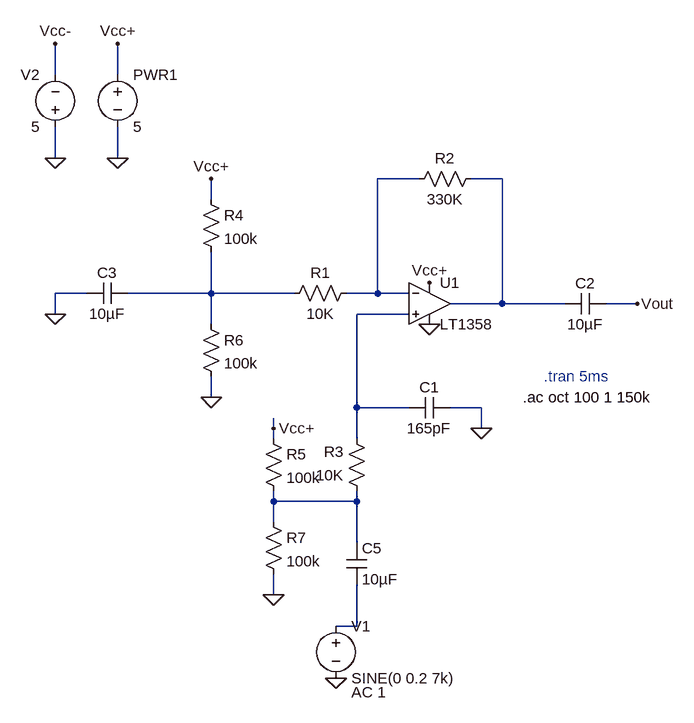
[diagram p0: schematic karens_new_amplifer_corrent_filtering.asc]
karens_new_amplifer_corrent_filtering.asc, the LTspice schematic file:
Version 4
SHEET 1 996 852
WIRE 32 -112 32 -160
WIRE 128 -112 128 -160
WIRE 32 16 32 -32
WIRE 128 16 128 -32
WIRE 592 48 528 48
WIRE 720 48 672 48
WIRE 272 80 272 48
WIRE 80 224 32 224
WIRE 272 224 272 160
WIRE 272 224 144 224
WIRE 400 224 272 224
WIRE 528 224 528 48
WIRE 528 224 480 224
WIRE 576 224 528 224
WIRE 720 240 720 48
WIRE 720 240 640 240
WIRE 816 240 720 240
WIRE 928 240 880 240
WIRE 32 256 32 224
WIRE 576 256 496 256
WIRE 272 272 272 224
WIRE 272 384 272 352
WIRE 496 400 496 256
WIRE 576 400 496 400
WIRE 688 400 640 400
WIRE 368 432 368 416
WIRE 688 432 688 400
WIRE 368 448 368 432
WIRE 496 448 496 400
WIRE 368 544 368 528
WIRE 496 544 496 528
WIRE 496 544 368 544
WIRE 368 576 368 544
WIRE 496 608 496 544
WIRE 368 688 368 656
WIRE 496 736 496 672
WIRE 496 736 464 736
FLAG 608 208 Vcc+
FLAG 608 272 0
FLAG 928 240 Vout
FLAG 272 48 Vcc+
FLAG 272 384 0
FLAG 32 256 0
FLAG 368 688 0
FLAG 368 432 Vcc+
FLAG 688 432 0
FLAG 464 816 0
FLAG 128 -160 Vcc+
FLAG 128 16 0
FLAG 32 16 0
FLAG 32 -160 Vcc-
SYMBOL Res 496 208 R90
WINDOW 0 0 56 VBottom 2
WINDOW 3 32 56 VTop 2
SYMATTR InstName R1
SYMATTR Value 10K
SYMBOL OpAmps/LT1358 608 176 R0
SYMATTR InstName U1
SYMBOL Res 688 32 R90
WINDOW 0 0 56 VBottom 2
WINDOW 3 32 56 VTop 2
SYMATTR InstName R2
SYMATTR Value 330K
SYMBOL Res 256 64 R0
SYMATTR InstName R4
SYMATTR Value 100k
SYMBOL Res 256 256 R0
SYMATTR InstName R6
SYMATTR Value 100k
SYMBOL Cap 144 208 R90
WINDOW 0 0 32 VBottom 2
WINDOW 3 32 32 VTop 2
SYMATTR InstName C3
SYMATTR Value 10µF
SYMBOL voltage 464 720 R0
WINDOW 123 24 118 Left 2
SYMATTR Value2 AC 1
SYMATTR InstName V1
SYMATTR Value SINE(0 0.2 7k)
SYMBOL Res 512 544 R180
WINDOW 0 36 76 Left 2
WINDOW 3 36 40 Left 2
SYMATTR InstName R3
SYMATTR Value 10K
SYMBOL Cap 480 608 R0
SYMATTR InstName C5
SYMATTR Value 10µF
SYMBOL Res 352 432 R0
SYMATTR InstName R5
SYMATTR Value 100k
SYMBOL Res 352 560 R0
SYMATTR InstName R7
SYMATTR Value 100k
SYMBOL Cap 640 384 R90
WINDOW 0 0 32 VBottom 2
WINDOW 3 32 32 VTop 2
SYMATTR InstName C1
SYMATTR Value 165pF
SYMBOL Voltage 128 -128 R0
SYMATTR InstName PWR1
SYMATTR Value 5
SYMBOL Voltage 32 -16 R180
WINDOW 0 24 96 Left 2
WINDOW 3 24 16 Left 2
SYMATTR InstName V2
SYMATTR Value 5
SYMBOL Cap 880 224 R90
WINDOW 0 0 32 VBottom 2
WINDOW 3 32 32 VTop 2
SYMATTR InstName C2
SYMATTR Value 10µF
TEXT 784 352 Left 2 ;.tran 5ms
TEXT 752 384 Left 2 !.ac oct 100 1 150k

The netlist it stands for:
* karens_new_amplifer_corrent_filtering.asc
R1 N001 N003 10K
XU1 N004 N001 Vcc+ 0 N002 LT1357  ; LT1358, pins In+ In- V+ V- OUT
R2 N002 N001 330K
R4 Vcc+ N003 100k
R6 N003 0 100k
C3 N003 0 10µF
V1 N006 0 SINE(0 0.2 7k) AC 1
R3 N005 N004 10K
C5 N005 N006 10µF
R5 Vcc+ N005 100k
R7 N005 0 100k
C1 0 N004 165pF
V§PWR1 Vcc+ 0 5
V2 0 Vcc- 5
C2 Vout N002 10µF
* .tran 5ms
.ac oct 100 1 150k
.lib LTC.lib
.backanno
.end